# Altium schematic sheet 2.PMIC_2.SchDoc
size A4; SheetNumber: 2; SheetTotal: 21
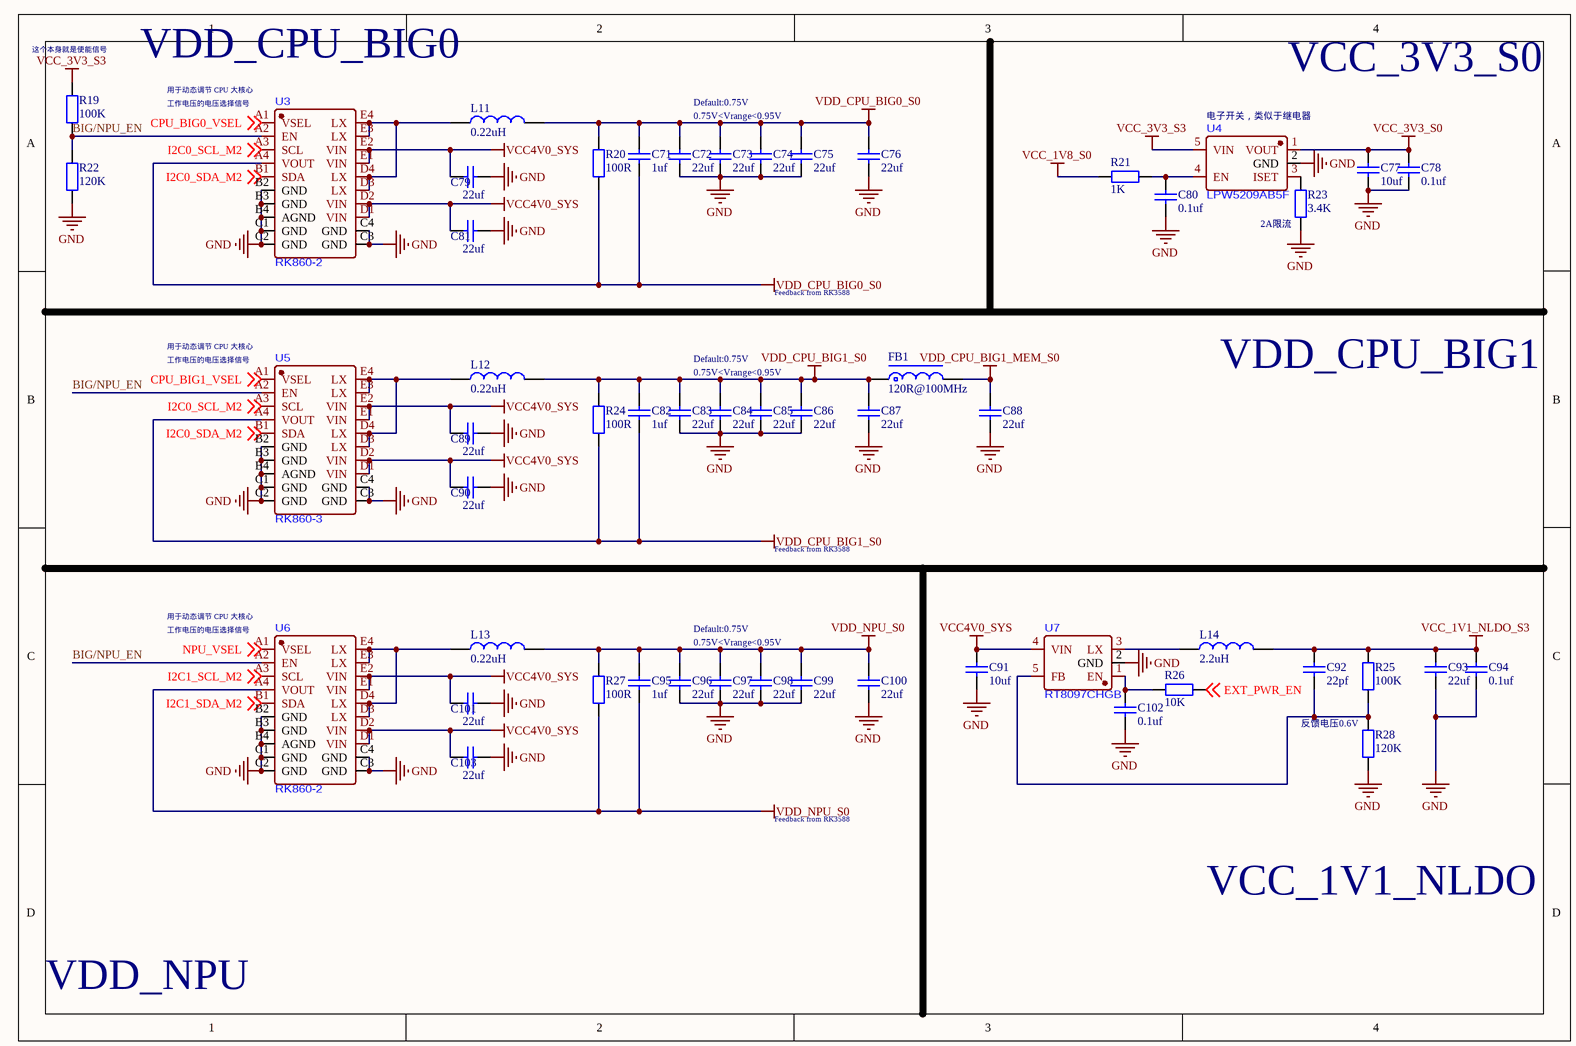
[diagram p0: 2.PMIC_2.SchDoc]

## Parts
C71  1uf  [C0402_L]
C72  22uf  [C0603_L]
C73  22uf  [C0603_L]
C74  22uf  [C0603_L]
C75  22uf  [C0603_L]
C76  22uf  [C0603_L]
C77  10uf  [C0402_L]
C78  0.1uf  [C0402_L]
C79  22uf  [C0603_L]
C80  0.1uf  [C0402_L]
C81  22uf  [C0603_L]
C82  1uf  [C0402_L]
C83  22uf  [C0603_L]
C84  22uf  [C0603_L]
C85  22uf  [C0603_L]
C86  22uf  [C0603_L]
C87  22uf  [C0603_L]
C88  22uf  [C0603_L]
C89  22uf  [C0603_L]
C90  22uf  [C0603_L]
C91  10uf  [C0402_L]
C92  22pf  [C0402_L]
C93  22uf  [C0603_L]
C94  0.1uf  [C0402_L]
C95  1uf  [C0402_L]
C96  22uf  [C0603_L]
C97  22uf  [C0603_L]
C98  22uf  [C0603_L]
C99  22uf  [C0603_L]
C100  22uf  [C0603_L]
C101  22uf  [C0603_L]
C102  0.1uf  [C0402_L]
C103  22uf  [C0603_L]
FB1  120R@100MHz  [FB0402]
L11  0.22uH  [L0805]
L12  0.22uH  [L0805]
L13  0.22uH  [L0805]
L14  2.2uH  [L0805]
R19  100K  [R0402_L]
R20  100R  [R0402_L]
R21  1K  [R0402_L]
R22  120K  [R0402_L]
R23  3.4K  [R0402_L]
R24  100R  [R0402_L]
R25  100K  [R0402_L]
R26  10K  [R0402_L]
R27  100R  [R0402_L]
R28  120K  [R0402_L]
U3  RK860-2  [WLCSP-20_L2.0-W1.6-R5-C4-P0.40-TL]
U4  LPW5209AB5F  [SOT-23-5_L3.0-W1.7-P0.95-LS2.8-BL]
U5  RK860-3  [WLCSP-20_L2.0-W1.6-R5-C4-P0.40-TL]
U6  RK860-2  [WLCSP-20_L2.0-W1.6-R5-C4-P0.40-TL]
U7  RT8097CHGB  [SOT-23-5_L3.0-W1.7-P0.95-LS2.8-BR]

## Nets
GND: C72.1 C73.1 C74.1 C75.1 C76.1 C77.1 C78.1 C79.1 C80.1 C81.1 C83.1 C84.1 C85.1 C86.1 C87.1 C88.1 C89.1 C90.1 C91.2 C93.1 C94.1 C96.1 C97.1 C98.1 C99.1 C100.1 C101.1 C102.1 C103.1 R22.1 R23.1 R28.1 U3.B2(GND) U3.B3(GND) U3.B4(AGND) U3.C1(GND) U3.C2(GND) U3.C3(GND) U3.C4(GND) U4.2(GND) U5.B2(GND) U5.B3(GND) U5.B4(AGND) U5.C1(GND) U5.C2(GND) U5.C3(GND) U5.C4(GND) U6.B2(GND) U6.B3(GND) U6.B4(AGND) U6.C1(GND) U6.C2(GND) U6.C3(GND) U6.C4(GND) U7.2(GND)
VCC4V0_SYS: C79.2 C81.2 C89.2 C90.2 C91.1 C101.2 C103.2 U3.D1(VIN) U3.D2(VIN) U3.E1(VIN) U3.E2(VIN) U5.D1(VIN) U5.D2(VIN) U5.E1(VIN) U5.E2(VIN) U6.D1(VIN) U6.D2(VIN) U6.E1(VIN) U6.E2(VIN) U7.4(VIN)
VCC_1V1_NLDO_S3: C92.2 C93.2 C94.2 L14.2 R25.2
VCC_1V8_S0: R21.1
VCC_3V3_S0: C77.2 C78.2 U4.1(VOUT)
VCC_3V3_S3: R19.2 U4.5(VIN)
VDD_CPU_BIG0_S0: C71.1 C71.2 C72.2 C73.2 C74.2 C75.2 C76.2 L11.2 R20.1 R20.2 U3.A4(VOUT)
VDD_CPU_BIG1_MEM_S0: C88.2 FB1.2
VDD_CPU_BIG1_S0: C82.1 C82.2 C83.2 C84.2 C85.2 C86.2 C87.2 FB1.1 L12.2 R24.1 R24.2 U5.A4(VOUT)
VDD_NPU_S0: C95.1 C95.2 C96.2 C97.2 C98.2 C99.2 C100.2 L13.2 R27.1 R27.2 U6.A4(VOUT)
BIG/NPU_EN: R19.1 R22.2 U3.A2(EN) U5.A2(EN) U6.A2(EN)
CPU_BIG0_VSEL: U3.A1(VSEL) ; off-sheet CPU_BIG0_VSEL
CPU_BIG1_VSEL: U5.A1(VSEL) ; off-sheet CPU_BIG1_VSEL
EXT_PWR_EN: R26.2 ; off-sheet EXT_PWR_EN
I2C0_SCL_M2: U3.A3(SCL) U5.A3(SCL) ; off-sheet I2C0_SCL_M2
I2C0_SDA_M2: U3.B1(SDA) U5.B1(SDA) ; off-sheet I2C0_SDA_M2
I2C1_SCL_M2: U6.A3(SCL) ; off-sheet I2C1_SCL_M2
I2C1_SDA_M2: U6.B1(SDA) ; off-sheet I2C1_SDA_M2
NPU_VSEL: U6.A1(VSEL) ; off-sheet NPU_VSEL
NetC80_2: C80.2 R21.2 U4.4(EN)
NetC92_1: C92.1 R25.1 R28.2 U7.5(FB)
NetC102_2: C102.2 R26.1 U7.1(EN)
NetL11_1: L11.1 U3.D3(LX) U3.D4(LX) U3.E3(LX) U3.E4(LX)
NetL12_1: L12.1 U5.D3(LX) U5.D4(LX) U5.E3(LX) U5.E4(LX)
NetL13_1: L13.1 U6.D3(LX) U6.D4(LX) U6.E3(LX) U6.E4(LX)
NetL14_1: L14.1 U7.3(LX)
NetR23_2: R23.2 U4.3(ISET)

## Notes on the sheet
- (near R19) 这个本身就是使能信号
- VDD_CPU_BIG0
- 用于动态调节 CPU 大核心
- 工作电压的电压选择信号
- Default:0.75V
- 0.75V<Vrange<0.95V
- (near U4) 电子开关，类似于继电器
- VCC_3V3_S0
- (near R23) 2A限流
- Feedback from RK3588
- VDD_CPU_BIG1
- 反馈电压0.6V
- VCC_1V1_NLDO
- VDD_NPU

## Library data of the parts
C71-C103 = C: 贴片电容/MLCC电容
FB1 = FB: 贴片磁珠
L11-L14 = L: 贴片小功率电感
R19-R28 = R: 贴片电阻